# Altium project top.PrjPCB
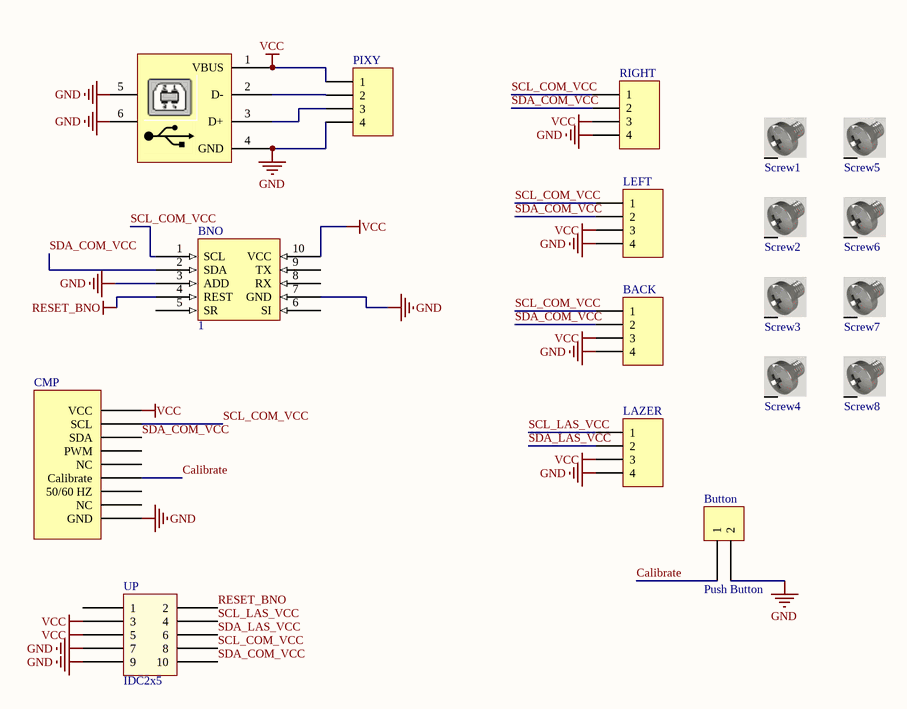
[diagram p0: top.SchDoc]
1 sheet, 18 parts. Net scope: global (net labels, ports and power ports of the same name join across sheets).
Board file: top.PcbDoc

## Sheet top.SchDoc
size A0

### Parts
BACK  LEFT  [HDR1X4]  (value not drawn)
BNO  1  [DIP10]
Button  Push Button  [Push Button]
CMP  CMP03  [CMP03]  (value not drawn)
LAZER  LEFT  [HDR1X4]  (value not drawn)
LEFT  LEFT  [HDR1X4]  (value not drawn)
PIXY  Header 4  [HDR1X4]  (value not drawn)
RIGHT  LEFT  [HDR1X4]  (value not drawn)
Screw1  Screw  [Screw]  (value not drawn)
Screw2  Screw  [Screw]  (value not drawn)
Screw3  Screw  [Screw]  (value not drawn)
Screw4  Screw  [Screw]  (value not drawn)
Screw5  Screw  [Screw]  (value not drawn)
Screw6  Screw  [Screw]  (value not drawn)
Screw7  Screw  [Screw]  (value not drawn)
Screw8  Screw  [Screw]  (value not drawn)
UP  IDC2x5  [IDC 2x5]
USB_B  USB_B  [USB_B.1]  (value not drawn)

### Nets
GND: BACK.4 BNO.3(ADD) BNO.7(GND) Button.2 CMP.9(GND) LAZER.4 LEFT.4 PIXY.4 RIGHT.4 UP.7 UP.9 USB_B.4(GND) USB_B.5 USB_B.6
RESET_BNO: BNO.4(REST) UP.2
VCC: BACK.3 BNO.10(VCC) CMP.1(VCC) LAZER.3 LEFT.3 PIXY.1 RIGHT.3 UP.3 UP.5 USB_B.1(VBUS)
Calibrate: Button.1 CMP.6(Calibrate)
SCL_COM_VCC: BACK.1 BNO.1(SCL) CMP.2(SCL) LEFT.1 RIGHT.1 UP.8
SCL_LAS_VCC: LAZER.1 UP.4
SDA_COM_VCC: BACK.2 BNO.2(SDA) CMP.3(SDA) LEFT.2 RIGHT.2 UP.10
SDA_LAS_VCC: LAZER.2 UP.6
NetPIXY_2: PIXY.2 USB_B.2(D-)
NetPIXY_3: PIXY.3 USB_B.3(D+)

Not connected (* = marked no-connect by the designer): BNO 5(SR) 6(SI) 8(RX) 9(TX); CMP 4(PWM) 5(NC) 7(50/60_HZ) 8(NC); Screw1 S; Screw2 S; Screw3 S; Screw4 S; Screw5 S; Screw6 S; Screw7 S; Screw8 S; UP 1

### Library data of the parts
BACK LAZER LEFT PIXY RIGHT = Header 4: Header, 4-Pin; LatestRevisionDate: 17-Jul-2002; LatestRevisionNote: Re-released for DXP Platform.; Publisher: Altium Limited
BNO = Gy955
UP = IDC 2x5
USB_B = USB_B: USB B; LatestRevisionDate: 17-Jul-2002; LatestRevisionNote: Re-released for DXP Platform.; Publisher: Altium Limited
Screw1-Screw8 = Screw: LatestRevisionDate: 17-Jul-2002; LatestRevisionNote: Re-released for DXP Platform.; Publisher: Altium Limited